# EAGLE design GPSBee (EAGLE 6.1)
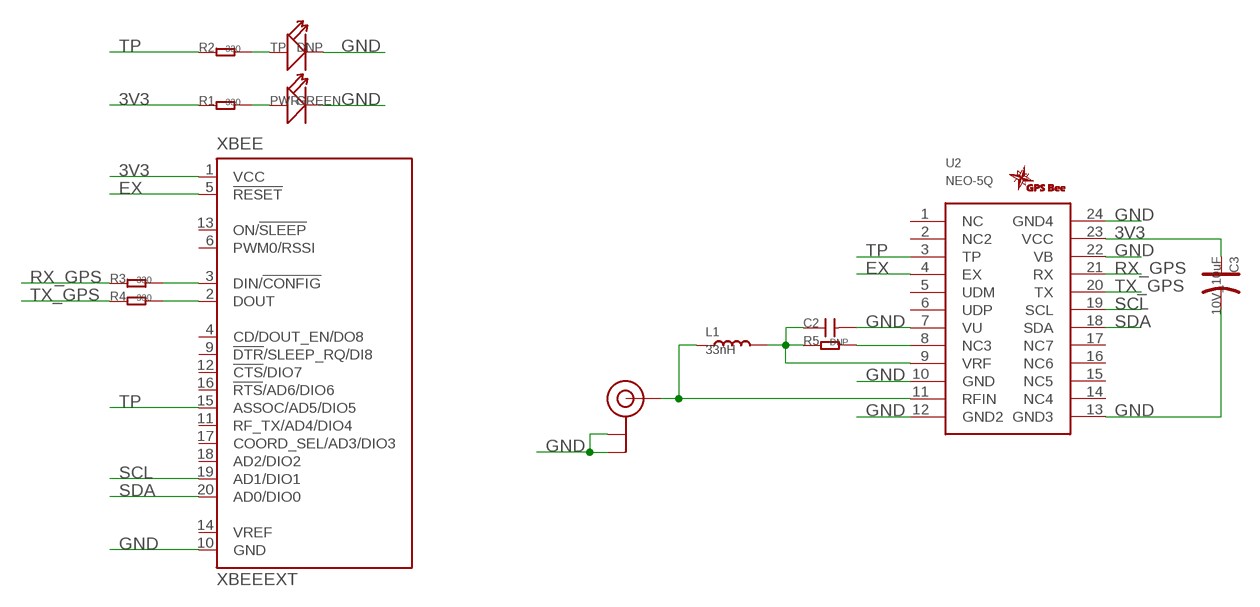
[diagram p0: schematic, sheet 1]

## Parts
C2  C-0603  [0603]
C3  10V_10uF  CAP-AVX-A  [AVX-A]
L1  33nH  L0603  [0603]
LOGO1  GPSLOGO_SLIK  [GPSLOGO]
PWR  GREEN  LED'0603'  [LED-0603]
R1  330  R-0603  [0603]
R2  330  R-0603  [0603]
R3  330  R-0603  [0603]
R4  330  R-0603  [0603]
R5  DNP  R-0603  [0603]
TP  DNP  LED'0603'  [LED-0603]
U2  NEO-5Q  [NEO-5Q]
U3  U.FL  [U.FL]
XBEE  XBEEEXT  [XBEE_PLUG]

## Nets
3V3: C3.+ R1.1 U2.23(VCC) XBEE.1(VCC)
EX: U2.4(EX) XBEE.5(!RESET)
GND: C2.2 C3.- PWR.- TP.- U2.7(VU) U2.10(GND) U2.12(GND2) U2.13(GND3) U2.22(VB) U2.24(GND4) U3.P$1(GND) U3.P$2(GND) XBEE.10(GND)
N$1: PWR.+ R1.2
N$2: L1.1 U2.11(RFIN) U3.P$3(SIGNAL)
N$3: C2.1 L1.2 R5.1 U2.9(VRF)
N$4: R3.2 XBEE.3(DIN/!CONFIG)
N$5: R2.2 TP.+
N$6: R4.2 XBEE.2(DOUT)
N$7: R5.2 U2.8(NC3)
RX_GPS: R3.1 U2.21(RX)
SCL: U2.19(SCL) XBEE.19(AD1/DIO1)
SDA: U2.18(SDA) XBEE.20(AD0/DIO0)
TP: R2.1 U2.3(TP) XBEE.15(ASSOC/AD5/DIO5)
TX_GPS: R4.1 U2.20(TX)
Unconnected: U2.1(NC) U2.2(NC2) U2.5(UDM) U2.6(UDP) U2.14(NC4) U2.15(NC5) U2.16(NC6) U2.17(NC7) XBEE.4(CD/DOUT_EN/DO8) XBEE.6(PWM0/RSSI) XBEE.9(!DTR!/SLEEP_RQ/DI8) XBEE.11(RF_TX/AD4/DIO4) XBEE.12(!CTS!/DIO7) XBEE.13(ON/!SLEEP) XBEE.14(VREF) XBEE.16(!RTS!/AD6/DIO6) XBEE.17(COORD_SEL/AD3/DIO3) XBEE.18(AD2/DIO2)

## Library data of the parts
C2 = Discrete:C*: Ceramic Capacitors
C3 = Discrete:CAP*: Electrolytic Capacitors,Tantalum Capacitors and Super Capacitors
L1 = Discrete:L*
LOGO1 = logo:GPSLOGO_SLIK
PWR TP = Discrete:LED*
R1-R5 = Discrete:R*
U2 = Seeed:NEO-5Q
U3 = SparkFun2:U.FL
XBEE = EXT_moudle:XBEE: XBee (TM) /XBee-PRO(TM) OEM RF Modules Source: MaxStream, Inc. xbee_productmanual.pdf

## Net classes
0 default: width 0.003 mm, drill 0.254 mm, clearance 0.152 mm

## Board
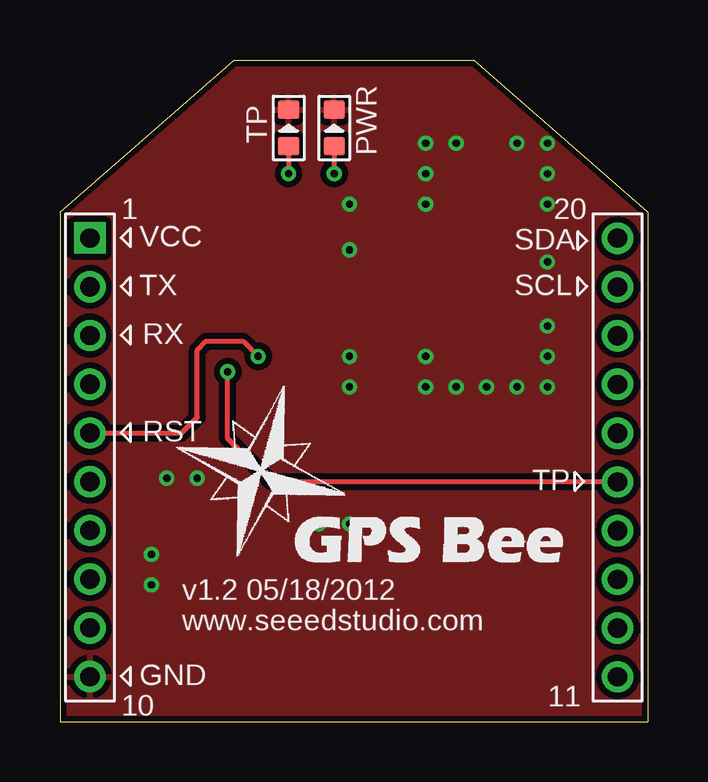
[diagram p1: board, top side]
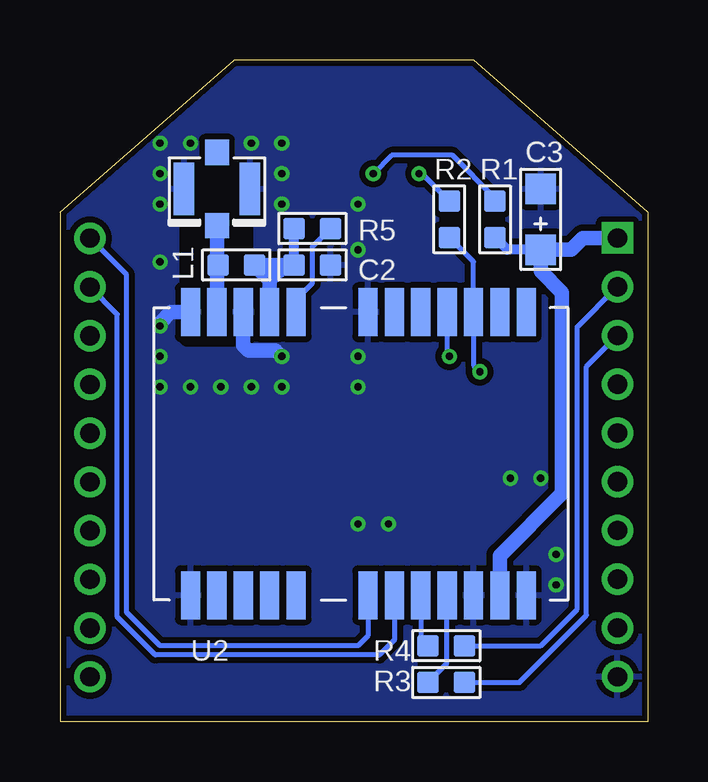
[diagram p2: board, bottom side, seen from below]

Size 24.5 x 27.6 mm. Coordinates in mm from the lower left corner, seen from the top.
Outline: 7.25,27.6 17.25,27.6 24.5,21.25 24.5,0 0,0 0,21.25 7.25,27.6
Copper layers (1*16): Top 0.035mm / dielectric 1.5mm / Bottom 0.035mm
Design rules "default *": minimum track width 6mil, minimum drill 12mil, track to track 6mil, track to pad 6mil, pad to pad 6mil, via to via 6mil, smd to smd 0mil, copper to edge 10mil, drill to drill 10mil, minimum pad ring 10mil, minimum via ring 6mil, stop-mask expansion 2mil, vias tented up to drill 100mil, thermal gap 10mil
bRestrict: 4 lines

### Footprints (pad centres in the part's own frame; a part is rotated, then mirrored left to right if it is on the bottom)
0603 = smd 0.889 x 0.889: 1 -0.762,0; 2 0.762,0
AVX-A = smd 1.27 x 1.27: + -1.27,0; - 1.27,0
LED-0603 = smd 0.762 x 0.889: + -0.762,0; - 0.762,0
NEO-5Q = smd 2 x 0.8: 1 12,-14; 2 12,-12.9; 3 12,-11.8; 4 12,-10.7; 5 12,-9.6; 6 12,-8.5; 7 12,-7.4; 8 12,-4.4; 9 12,-3.3; 10 12,-2.2; 11 12,-1.1; 12 12,0; 13 0.2,0; 14 0.2,-1.1; 15 0.2,-2.2; 16 0.2,-3.3; 17 0.2,-4.4; 18 0.2,-7.4; 19 0.2,-8.5; 20 0.2,-9.6; 21 0.2,-10.7; 22 0.2,-11.8; 23 0.2,-12.9; 24 0.2,-14
U.FL = smd 2.2 x 0.85: P$1 0,1.375; P$2 0,-1.375 | smd 1.05 x 1: P$3 1.525,0; P$4 -1.525,0
XBEE_PLUG = drill 0.8 pad 1.27 square: 1 0,0.008 | drill 0.8 pad 1.27: 2 0,-2.024; 3 0,-4.056; 4 0,-6.088; 5 0,-8.12; 6 0,-10.152; 7 0,-12.184; 8 0,-14.216; 9 0,-16.248; 10 0,-18.28; 11 21.996,-18.288; 12 21.996,-16.256; 13 21.996,-14.224; 14 21.996,-12.192; 15 21.996,-10.16; 16 21.996,-8.128; 17 21.996,-6.096; 18 21.996,-4.064; 19 21.996,-2.032; 20 21.996,0

### Placement (x,y rotation side)
C2  13.98,19.05 0 bottom
C3  4.45,20.95 90 bottom
L1  17.15,19.05 0 bottom
LOGO1  4.45,5.71 0 top
PWR  11.44,24.77 90 top
R1  6.36,20.95 90 bottom
R2  8.26,20.95 90 bottom
R3  8.39,1.65 0 bottom
R4  8.39,3.17 0 bottom
R5  13.98,20.57 0 bottom
TP  9.53,24.77 90 top
U2  19.06,5.08 90 bottom
U3  17.96,22.23 270 bottom
XBEE  1.25,20.17 0 top

### Tracks (layer width: path | path; a pad name or v marks a point on that pad's centre or on a via)
3V3
  Bottom 0.406: C3.+ 5.85,19.68 R1.1
  Bottom 0.61: XBEE.1 2.69,20.18 3.18,19.68 C3.+ 4.45,18.8 3.56,17.91 3.56,9.53 6.16,6.93 U2.23
EX  (via drill 0.3 pad 0.64)
  Top 0.203: XBEE.5 5.07,12.05 5.72,12.7 5.72,15.49 6.1,15.88 7.63,15.88 v8.26,15.24
  Bottom 0.203: U2.4 8.36,15.34 v8.26,15.24
GND  (via drill 0.3 pad 0.64)
  Bottom 0.61: U2.12 19.88,17.08 20.33,16.64 v20.33,16.51 | U2.10 16.86,15.71 16.64,15.49 15.5,15.49 v15.25,15.24
  other vias: 15.25,21.59 15.25,22.86 15.25,24.13 16.52,24.13 20.33,24.13 20.33,22.86 20.33,21.59 20.33,15.24 19.06,13.97 17.79,13.97 16.52,13.97 15.25,13.97 20.33,19.18 19.06,24.13 20.33,13.97 3.82,6.99 5.72,10.16 3.82,5.71 4.45,10.16 10.8,8.26 12.07,15.24 12.07,13.97 12.07,19.68 12.07,21.59 12.07,8.26
  pour Bottom (isolate 0.254): 0.01,27.94 24.77,27.94 24.77,0 0.01,0
  pour Top (isolate 0.254): 0.01,27.94 24.77,27.94 24.77,0 0.01,0
N$1  (via drill 0.3 pad 0.64)
  Top 0.203: PWR.+ v11.44,22.86
  Bottom 0.203: R1.2 6.36,21.84 8.14,23.62 10.68,23.62 v11.44,22.86
N$2
  Bottom 0.61: U3.P$3 U2.11 17.96,19.01 L1.1
N$3
  Bottom 0.406: C2.1 R5.1
  Bottom 0.61: U2.9 15.76,18.42 | 15.76,18.42 L1.2 15.12,19.05 | C2.1 14.87,19.05 15.12,19.05 | 15.12,19.05 15.76,18.42
N$4
  Bottom 0.203: XBEE.3 2.55,14.82 2.55,4.45 5.34,1.65 R3.2
N$5  (via drill 0.3 pad 0.64)
  Top 0.203: TP.+ v9.53,22.86
  Bottom 0.203: v9.53,22.86 9.41,22.86 R2.2
N$6
  Bottom 0.203: R4.2 4.45,3.17 2.93,4.7 2.93,16.47 XBEE.2
N$7
  Bottom 0.203: U2.8 14.66,17.61 13.98,18.29 13.98,19.81 R5.2
RX_GPS
  Bottom 0.203: U2.21 8.36,4.48 8.39,4.45 8.39,2.41 R3.1
SCL
  Bottom 0.203: U2.19 10.56,3.42 11.18,2.79 20.53,2.79 22.11,4.37 22.11,16.99 XBEE.19
SDA
  Bottom 0.203: U2.18 11.66,3.59 12.07,3.17 20.33,3.17 21.72,4.57 21.72,18.64 XBEE.20
TP  (via drill 0.3 pad 0.64)
  Top 0.203: XBEE.15 8.8,10.01 6.99,11.81 v6.99,14.61
  Bottom 0.203: R2.1 7.26,19.19 U2.3 7.26,14.87 v6.99,14.61
TX_GPS
  Bottom 0.203: U2.20 9.46,3.48 R4.1

### Text on the board
tPlace: 1 | 20 | VCC | SDA | TX | SCL | RX | RST | TP | v1.2 05/18/2012 | www.seeedstudio.com | GND | 11 | 10